# Altium schematic sheet CONNECT.SchDoc
size A4 portrait
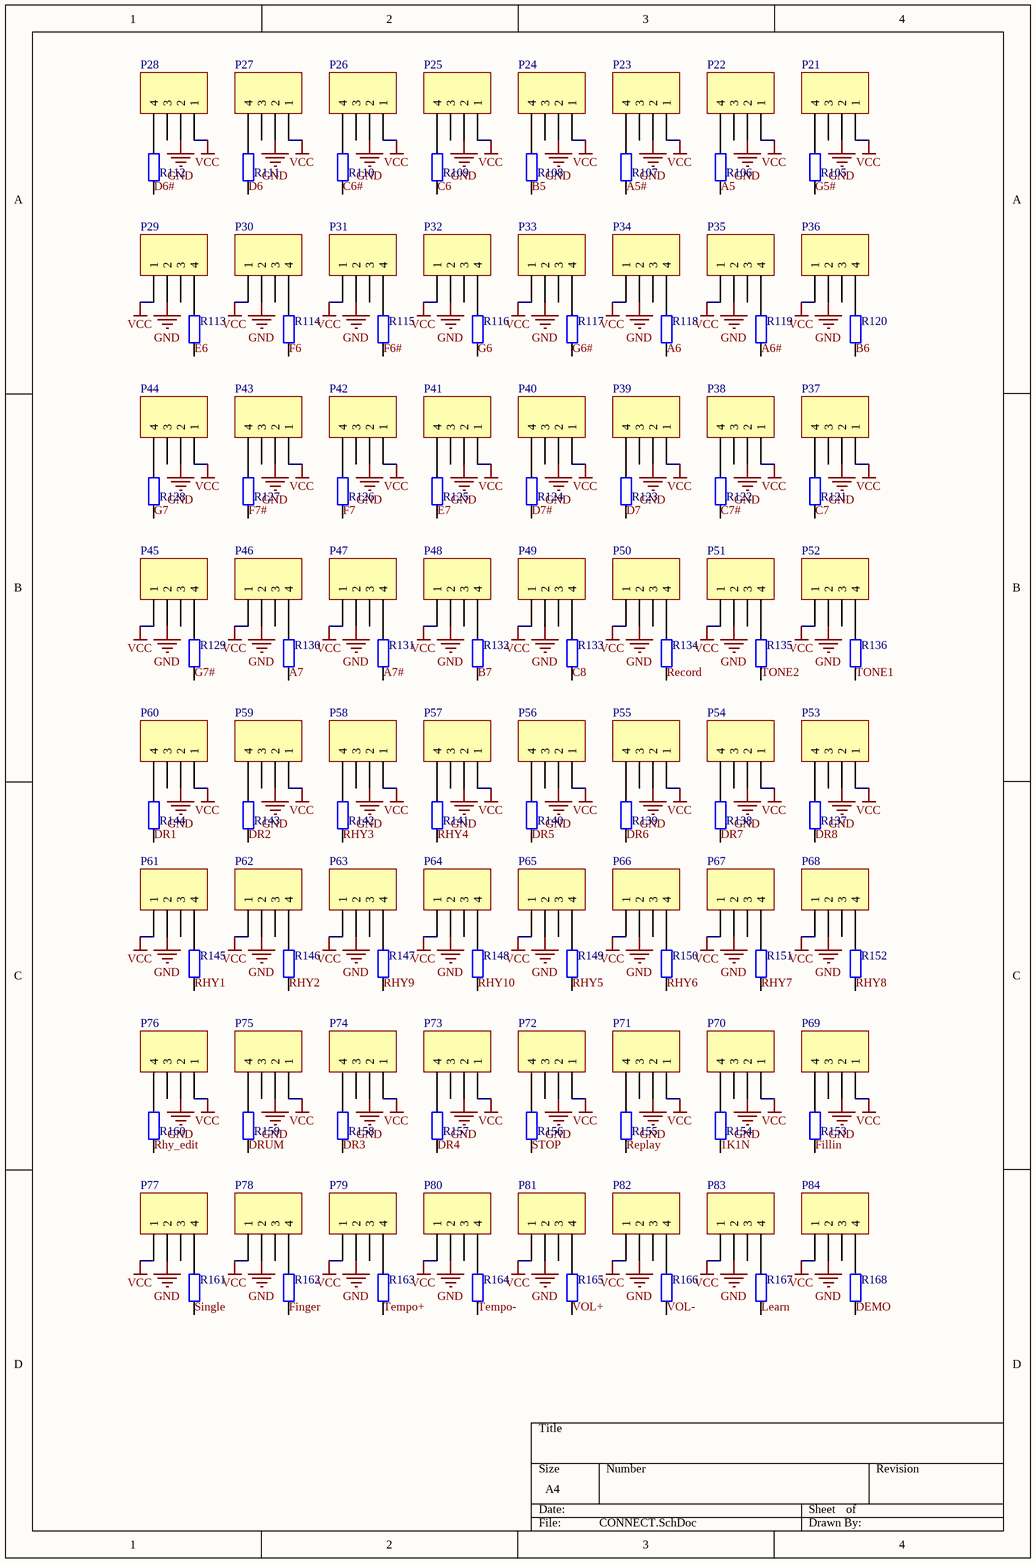
[diagram p0: CONNECT.SchDoc]

## Parts
P21  Header 4  [FPC1.0-2H-WS-4P]  (value not drawn)
P22  Header 4  [FPC1.0-2H-WS-4P]  (value not drawn)
P23  Header 4  [FPC1.0-2H-WS-4P]  (value not drawn)
P24  Header 4  [FPC1.0-2H-WS-4P]  (value not drawn)
P25  Header 4  [FPC1.0-2H-WS-4P]  (value not drawn)
P26  Header 4  [FPC1.0-2H-WS-4P]  (value not drawn)
P27  Header 4  [FPC1.0-2H-WS-4P]  (value not drawn)
P28  Header 4  [FPC1.0-2H-WS-4P]  (value not drawn)
P29  Header 4  [FPC1.0-2H-WS-4P]  (value not drawn)
P30  Header 4  [FPC1.0-2H-WS-4P]  (value not drawn)
P31  Header 4  [FPC1.0-2H-WS-4P]  (value not drawn)
P32  Header 4  [FPC1.0-2H-WS-4P]  (value not drawn)
P33  Header 4  [FPC1.0-2H-WS-4P]  (value not drawn)
P34  Header 4  [FPC1.0-2H-WS-4P]  (value not drawn)
P35  Header 4  [FPC1.0-2H-WS-4P]  (value not drawn)
P36  Header 4  [FPC1.0-2H-WS-4P]  (value not drawn)
P37  Header 4  [FPC1.0-2H-WS-4P]  (value not drawn)
P38  Header 4  [FPC1.0-2H-WS-4P]  (value not drawn)
P39  Header 4  [FPC1.0-2H-WS-4P]  (value not drawn)
P40  Header 4  [FPC1.0-2H-WS-4P]  (value not drawn)
P41  Header 4  [FPC1.0-2H-WS-4P]  (value not drawn)
P42  Header 4  [FPC1.0-2H-WS-4P]  (value not drawn)
P43  Header 4  [FPC1.0-2H-WS-4P]  (value not drawn)
P44  Header 4  [FPC1.0-2H-WS-4P]  (value not drawn)
P45  Header 4  [FPC1.0-2H-WS-4P]  (value not drawn)
P46  Header 4  [FPC1.0-2H-WS-4P]  (value not drawn)
P47  Header 4  [FPC1.0-2H-WS-4P]  (value not drawn)
P48  Header 4  [FPC1.0-2H-WS-4P]  (value not drawn)
P49  Header 4  [FPC1.0-2H-WS-4P]  (value not drawn)
P50  Header 4  [FPC1.0-2H-WS-4P]  (value not drawn)
P51  Header 4  [FPC1.0-2H-WS-4P]  (value not drawn)
P52  Header 4  [FPC1.0-2H-WS-4P]  (value not drawn)
P53  Header 4  [FPC1.0-2H-WS-4P]  (value not drawn)
P54  Header 4  [FPC1.0-2H-WS-4P]  (value not drawn)
P55  Header 4  [FPC1.0-2H-WS-4P]  (value not drawn)
P56  Header 4  [FPC1.0-2H-WS-4P]  (value not drawn)
P57  Header 4  [FPC1.0-2H-WS-4P]  (value not drawn)
P58  Header 4  [FPC1.0-2H-WS-4P]  (value not drawn)
P59  Header 4  [FPC1.0-2H-WS-4P]  (value not drawn)
P60  Header 4  [FPC1.0-2H-WS-4P]  (value not drawn)
P61  Header 4  [FPC1.0-2H-WS-4P]  (value not drawn)
P62  Header 4  [FPC1.0-2H-WS-4P]  (value not drawn)
P63  Header 4  [FPC1.0-2H-WS-4P]  (value not drawn)
P64  Header 4  [FPC1.0-2H-WS-4P]  (value not drawn)
P65  Header 4  [FPC1.0-2H-WS-4P]  (value not drawn)
P66  Header 4  [FPC1.0-2H-WS-4P]  (value not drawn)
P67  Header 4  [FPC1.0-2H-WS-4P]  (value not drawn)
P68  Header 4  [FPC1.0-2H-WS-4P]  (value not drawn)
P69  Header 4  [FPC1.0-2H-WS-4P]  (value not drawn)
P70  Header 4  [FPC1.0-2H-WS-4P]  (value not drawn)
P71  Header 4  [FPC1.0-2H-WS-4P]  (value not drawn)
P72  Header 4  [FPC1.0-2H-WS-4P]  (value not drawn)
P73  Header 4  [FPC1.0-2H-WS-4P]  (value not drawn)
P74  Header 4  [FPC1.0-2H-WS-4P]  (value not drawn)
P75  Header 4  [FPC1.0-2H-WS-4P]  (value not drawn)
P76  Header 4  [FPC1.0-2H-WS-4P]  (value not drawn)
P77  Header 4  [FPC1.0-2H-WS-4P]  (value not drawn)
P78  Header 4  [FPC1.0-2H-WS-4P]  (value not drawn)
P79  Header 4  [FPC1.0-2H-WS-4P]  (value not drawn)
P80  Header 4  [FPC1.0-2H-WS-4P]  (value not drawn)
P81  Header 4  [FPC1.0-2H-WS-4P]  (value not drawn)
P82  Header 4  [FPC1.0-2H-WS-4P]  (value not drawn)
P83  Header 4  [FPC1.0-2H-WS-4P]  (value not drawn)
P84  Header 4  [FPC1.0-2H-WS-4P]  (value not drawn)
R105  1KΩ (1001) ±1%  [0603_R]  (value not drawn)
R106  1KΩ (1001) ±1%  [0603_R]  (value not drawn)
R107  1KΩ (1001) ±1%  [0603_R]  (value not drawn)
R108  1KΩ (1001) ±1%  [0603_R]  (value not drawn)
R109  1KΩ (1001) ±1%  [0603_R]  (value not drawn)
R110  1KΩ (1001) ±1%  [0603_R]  (value not drawn)
R111  1KΩ (1001) ±1%  [0603_R]  (value not drawn)
R112  1KΩ (1001) ±1%  [0603_R]  (value not drawn)
R113  1KΩ (1001) ±1%  [0603_R]  (value not drawn)
R114  1KΩ (1001) ±1%  [0603_R]  (value not drawn)
R115  1KΩ (1001) ±1%  [0603_R]  (value not drawn)
R116  1KΩ (1001) ±1%  [0603_R]  (value not drawn)
R117  1KΩ (1001) ±1%  [0603_R]  (value not drawn)
R118  1KΩ (1001) ±1%  [0603_R]  (value not drawn)
R119  1KΩ (1001) ±1%  [0603_R]  (value not drawn)
R120  1KΩ (1001) ±1%  [0603_R]  (value not drawn)
R121  1KΩ (1001) ±1%  [0603_R]  (value not drawn)
R122  1KΩ (1001) ±1%  [0603_R]  (value not drawn)
R123  1KΩ (1001) ±1%  [0603_R]  (value not drawn)
R124  1KΩ (1001) ±1%  [0603_R]  (value not drawn)
R125  1KΩ (1001) ±1%  [0603_R]  (value not drawn)
R126  1KΩ (1001) ±1%  [0603_R]  (value not drawn)
R127  1KΩ (1001) ±1%  [0603_R]  (value not drawn)
R128  1KΩ (1001) ±1%  [0603_R]  (value not drawn)
R129  1KΩ (1001) ±1%  [0603_R]  (value not drawn)
R130  1KΩ (1001) ±1%  [0603_R]  (value not drawn)
R131  1KΩ (1001) ±1%  [0603_R]  (value not drawn)
R132  1KΩ (1001) ±1%  [0603_R]  (value not drawn)
R133  1KΩ (1001) ±1%  [0603_R]  (value not drawn)
R134  1KΩ (1001) ±1%  [0603_R]  (value not drawn)
R135  1KΩ (1001) ±1%  [0603_R]  (value not drawn)
R136  1KΩ (1001) ±1%  [0603_R]  (value not drawn)
R137  1KΩ (1001) ±1%  [0603_R]  (value not drawn)
R138  1KΩ (1001) ±1%  [0603_R]  (value not drawn)
R139  1KΩ (1001) ±1%  [0603_R]  (value not drawn)
R140  1KΩ (1001) ±1%  [0603_R]  (value not drawn)
R141  1KΩ (1001) ±1%  [0603_R]  (value not drawn)
R142  1KΩ (1001) ±1%  [0603_R]  (value not drawn)
R143  1KΩ (1001) ±1%  [0603_R]  (value not drawn)
R144  1KΩ (1001) ±1%  [0603_R]  (value not drawn)
R145  1KΩ (1001) ±1%  [0603_R]  (value not drawn)
R146  1KΩ (1001) ±1%  [0603_R]  (value not drawn)
R147  1KΩ (1001) ±1%  [0603_R]  (value not drawn)
R148  1KΩ (1001) ±1%  [0603_R]  (value not drawn)
R149  1KΩ (1001) ±1%  [0603_R]  (value not drawn)
R150  1KΩ (1001) ±1%  [0603_R]  (value not drawn)
R151  1KΩ (1001) ±1%  [0603_R]  (value not drawn)
R152  1KΩ (1001) ±1%  [0603_R]  (value not drawn)
R153  1KΩ (1001) ±1%  [0603_R]  (value not drawn)
R154  1KΩ (1001) ±1%  [0603_R]  (value not drawn)
R155  1KΩ (1001) ±1%  [0603_R]  (value not drawn)
R156  1KΩ (1001) ±1%  [0603_R]  (value not drawn)
R157  1KΩ (1001) ±1%  [0603_R]  (value not drawn)
R158  1KΩ (1001) ±1%  [0603_R]  (value not drawn)
R159  1KΩ (1001) ±1%  [0603_R]  (value not drawn)
R160  1KΩ (1001) ±1%  [0603_R]  (value not drawn)
R161  1KΩ (1001) ±1%  [0603_R]  (value not drawn)
R162  1KΩ (1001) ±1%  [0603_R]  (value not drawn)
R163  1KΩ (1001) ±1%  [0603_R]  (value not drawn)
R164  1KΩ (1001) ±1%  [0603_R]  (value not drawn)
R165  1KΩ (1001) ±1%  [0603_R]  (value not drawn)
R166  1KΩ (1001) ±1%  [0603_R]  (value not drawn)
R167  1KΩ (1001) ±1%  [0603_R]  (value not drawn)
R168  1KΩ (1001) ±1%  [0603_R]  (value not drawn)

## Nets
GND: P21.2 P22.2 P23.2 P24.2 P25.2 P26.2 P27.2 P28.2 P29.2 P30.2 P31.2 P32.2 P33.2 P34.2 P35.2 P36.2 P37.2 P38.2 P39.2 P40.2 P41.2 P42.2 P43.2 P44.2 P45.2 P46.2 P47.2 P48.2 P49.2 P50.2 P51.2 P52.2 P53.2 P54.2 P55.2 P56.2 P57.2 P58.2 P59.2 P60.2 P61.2 P62.2 P63.2 P64.2 P65.2 P66.2 P67.2 P68.2 P69.2 P70.2 P71.2 P72.2 P73.2 P74.2 P75.2 P76.2 P77.2 P78.2 P79.2 P80.2 P81.2 P82.2 P83.2 P84.2
VCC: P21.1 P22.1 P23.1 P24.1 P25.1 P26.1 P27.1 P28.1 P29.1 P30.1 P31.1 P32.1 P33.1 P34.1 P35.1 P36.1 P37.1 P38.1 P39.1 P40.1 P41.1 P42.1 P43.1 P44.1 P45.1 P46.1 P47.1 P48.1 P49.1 P50.1 P51.1 P52.1 P53.1 P54.1 P55.1 P56.1 P57.1 P58.1 P59.1 P60.1 P61.1 P62.1 P63.1 P64.1 P65.1 P66.1 P67.1 P68.1 P69.1 P70.1 P71.1 P72.1 P73.1 P74.1 P75.1 P76.1 P77.1 P78.1 P79.1 P80.1 P81.1 P82.1 P83.1 P84.1
1K1N: R154.1
A5: R106.1
A5#: R107.1
A6: R118.1
A6#: R119.1
A7: R130.1
A7#: R131.1
B5: R108.1
B6: R120.1
B7: R132.1
C6: R109.1
C6#: R110.1
C7: R121.1
C7#: R122.1
C8: R133.1
D6: R111.1
D6#: R112.1
D7: R123.1
D7#: R124.1
DEMO: R168.1
DR1: R144.1
DR2: R143.1
DR3: R158.1
DR4: R157.1
DR5: R140.1
DR6: R139.1
DR7: R138.1
DR8: R137.1
DRUM: R159.1
E6: R113.1
E7: R125.1
F6: R114.1
F6#: R115.1
F7: R126.1
F7#: R127.1
Fillin: R153.1
Finger: R162.1
G5#: R105.1
G6: R116.1
G6#: R117.1
G7: R128.1
G7#: R129.1
Learn: R167.1
Record: R134.1
Replay: R155.1
RHY1: R145.1
RHY2: R146.1
RHY3: R142.1
RHY4: R141.1
RHY5: R149.1
RHY6: R150.1
RHY7: R151.1
RHY8: R152.1
RHY9: R147.1
RHY10: R148.1
Rhy_edit: R160.1
Single: R161.1
STOP: R156.1
Tempo+: R163.1
Tempo-: R164.1
TONE1: R136.1
TONE2: R135.1
VOL+: R165.1
VOL-: R166.1
NetP21_4: P21.4 R105.2
NetP22_4: P22.4 R106.2
NetP23_4: P23.4 R107.2
NetP24_4: P24.4 R108.2
NetP25_4: P25.4 R109.2
NetP26_4: P26.4 R110.2
NetP27_4: P27.4 R111.2
NetP28_4: P28.4 R112.2
NetP29_4: P29.4 R113.2
NetP30_4: P30.4 R114.2
NetP31_4: P31.4 R115.2
NetP32_4: P32.4 R116.2
NetP33_4: P33.4 R117.2
NetP34_4: P34.4 R118.2
NetP35_4: P35.4 R119.2
NetP36_4: P36.4 R120.2
NetP37_4: P37.4 R121.2
NetP38_4: P38.4 R122.2
NetP39_4: P39.4 R123.2
NetP40_4: P40.4 R124.2
NetP41_4: P41.4 R125.2
NetP42_4: P42.4 R126.2
NetP43_4: P43.4 R127.2
NetP44_4: P44.4 R128.2
NetP45_4: P45.4 R129.2
NetP46_4: P46.4 R130.2
NetP47_4: P47.4 R131.2
NetP48_4: P48.4 R132.2
NetP49_4: P49.4 R133.2
NetP50_4: P50.4 R134.2
NetP51_4: P51.4 R135.2
NetP52_4: P52.4 R136.2
NetP53_4: P53.4 R137.2
NetP54_4: P54.4 R138.2
NetP55_4: P55.4 R139.2
NetP56_4: P56.4 R140.2
NetP57_4: P57.4 R141.2
NetP58_4: P58.4 R142.2
NetP59_4: P59.4 R143.2
NetP60_4: P60.4 R144.2
NetP61_4: P61.4 R145.2
NetP62_4: P62.4 R146.2
NetP63_4: P63.4 R147.2
NetP64_4: P64.4 R148.2
NetP65_4: P65.4 R149.2
NetP66_4: P66.4 R150.2
NetP67_4: P67.4 R151.2
NetP68_4: P68.4 R152.2
NetP69_4: P69.4 R153.2
NetP70_4: P70.4 R154.2
NetP71_4: P71.4 R155.2
NetP72_4: P72.4 R156.2
NetP73_4: P73.4 R157.2
NetP74_4: P74.4 R158.2
NetP75_4: P75.4 R159.2
NetP76_4: P76.4 R160.2
NetP77_4: P77.4 R161.2
NetP78_4: P78.4 R162.2
NetP79_4: P79.4 R163.2
NetP80_4: P80.4 R164.2
NetP81_4: P81.4 R165.2
NetP82_4: P82.4 R166.2
NetP83_4: P83.4 R167.2
NetP84_4: P84.4 R168.2

Not connected (* = marked no-connect by the designer): P21 3; P22 3; P23 3; P24 3; P25 3; P26 3; P27 3; P28 3; P29 3; P30 3; P31 3; P32 3; P33 3; P34 3; P35 3; P36 3; P37 3; P38 3; P39 3; P40 3; P41 3; P42 3; P43 3; P44 3; P45 3; P46 3; P47 3; P48 3; P49 3; P50 3; P51 3; P52 3; P53 3; P54 3; P55 3; P56 3; P57 3; P58 3; P59 3; P60 3; P61 3; P62 3; P63 3; P64 3; P65 3; P66 3; P67 3; P68 3; P69 3; P70 3; P71 3; P72 3; P73 3; P74 3; P75 3; P76 3; P77 3; P78 3; P79 3; P80 3; P81 3; P82 3; P83 3; P84 3

## Library data of the parts
P21-P84 = Header 4: Header, 4-Pin; LatestRevisionDate: 17-Jul-2002; LatestRevisionNote: Re-released for DXP Platform.; Publisher: Altium Limited
R105-R168 = 0603 1KΩ (1001) 1%: 贴片电阻; ComponentLink1Description: 供应商链接; ComponentLink1URL: http://www.szlcsc.com/product/details_21904.html; Package: 0603; Supplier: LC; SuppliersPartNumber: C21190